# Altium schematic sheet Block Diagram.SchDoc
size B; Author: E. Sims; Organization: Let's Build Rockets Inc.; SheetNumber: 9; SheetTotal: 9
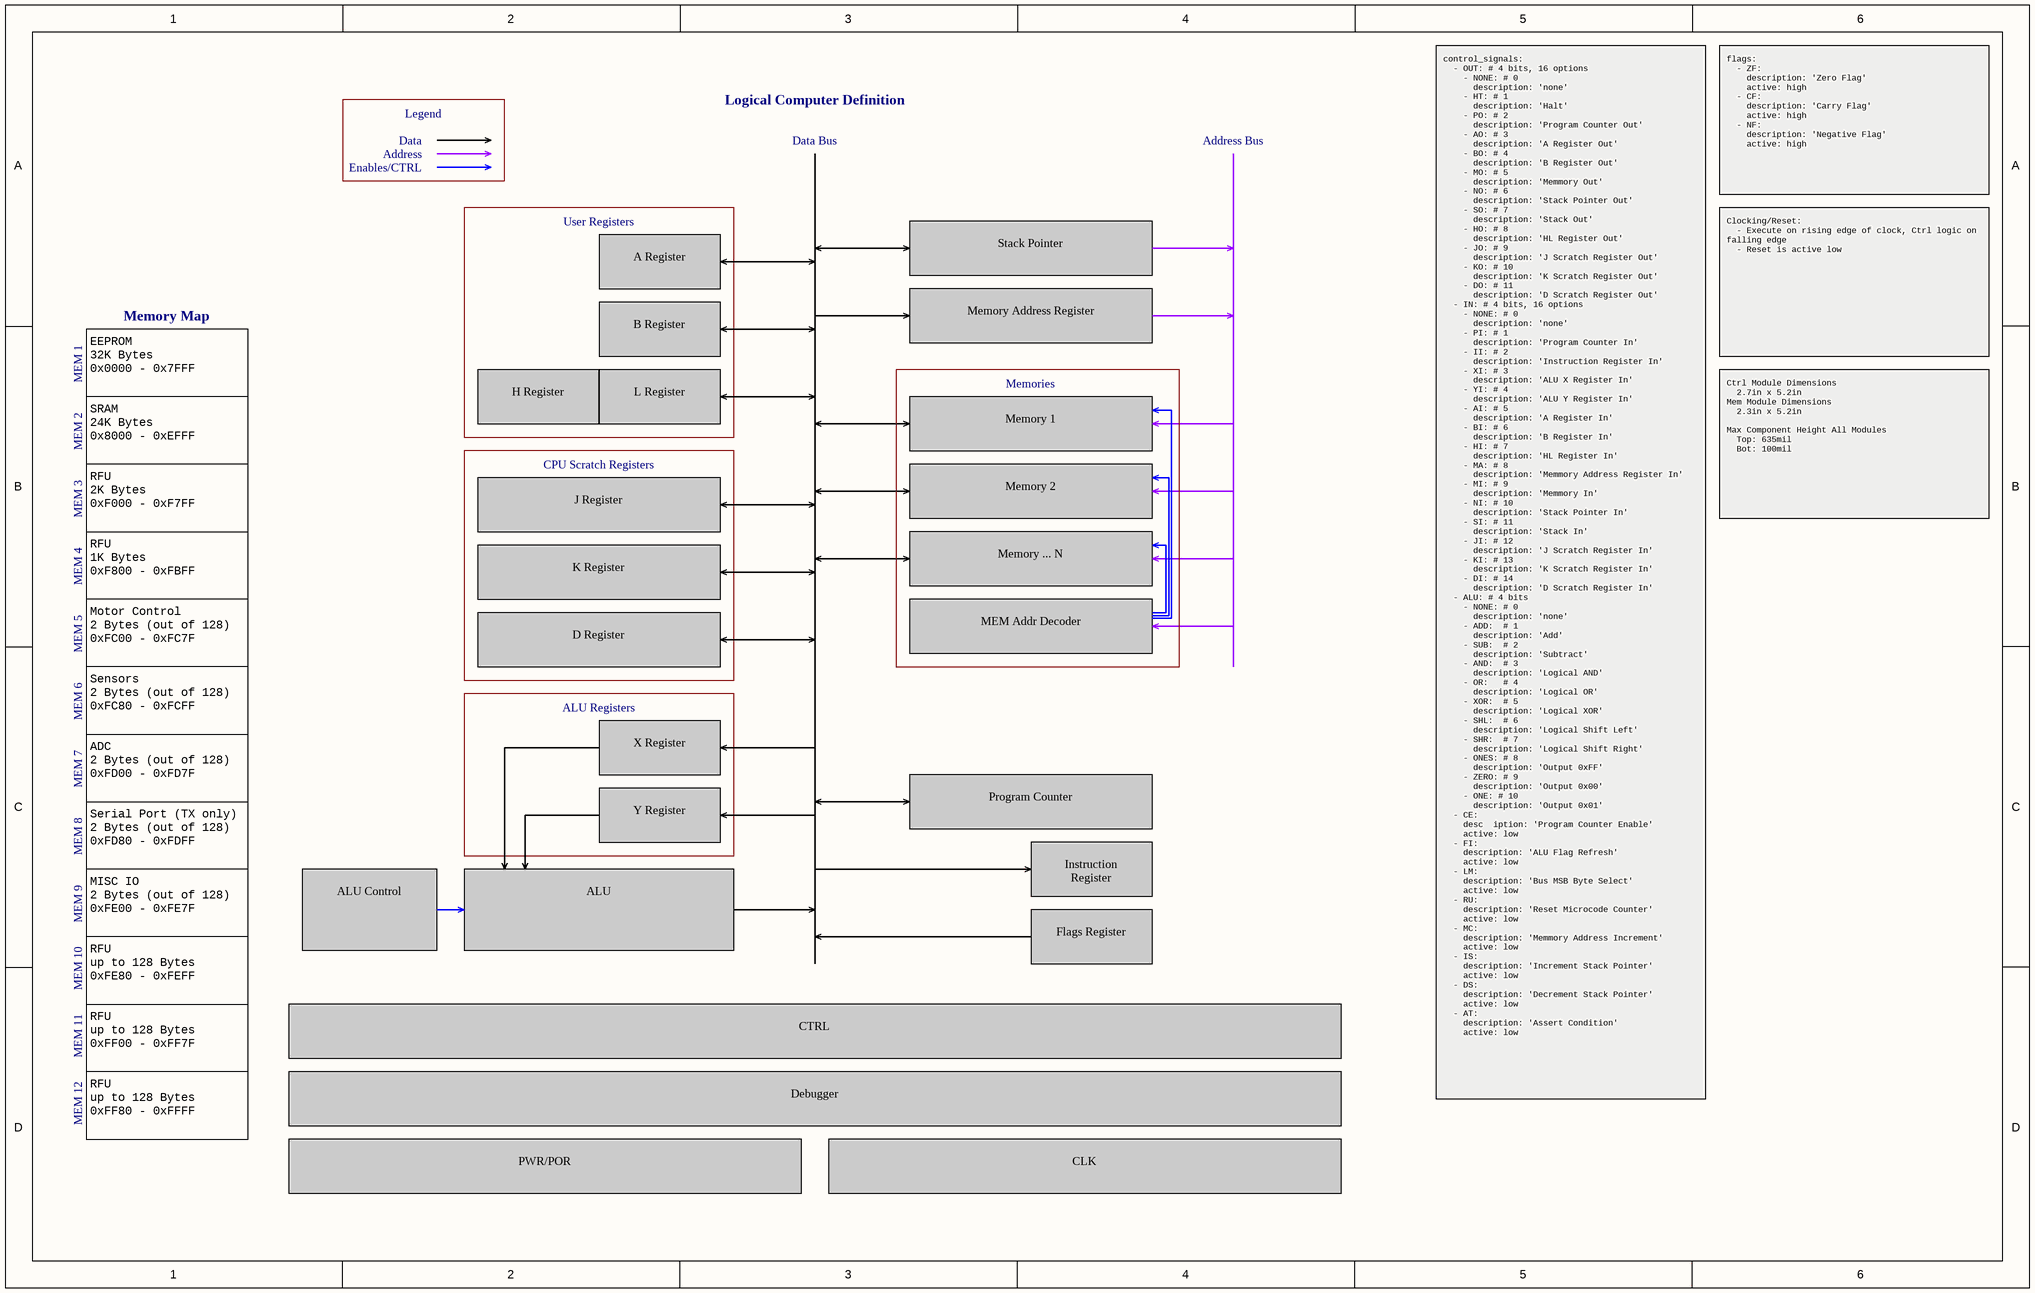
[diagram p0: Block Diagram.SchDoc]

## Notes on the sheet
- Logical Computer Definition
- Data
- Address
- Enables/CTRL
- Legend
- Data Bus
- Address Bus
- User Registers
- flags:
  - ZF:
  description: 'Zero Flag'
  active: high
  - CF:
  description: 'Carry Flag'
  active: high
  - NF:
  description: 'Negative Flag'
  active: high
- A Register
- Stack Pointer
- Memory Map
- B Register
- Memory Address Register
- Clocking/Reset:
  - Execute on rising edge of clock, Ctrl logic on falling edge
  - Reset is active low
- EEPROM
  32K Bytes
  0x0000 - 0x7FFF
- MEM 1
- H Register
- L Register
- Memories
- SRAM
  24K Bytes
  0x8000 - 0xEFFF
- MEM 2
- CPU Scratch Registers
- Memory 1
- RFU
  2K Bytes
  0xF000 - 0xF7FF
- MEM 3
- J Register
- Memory 2
- Ctrl Module Dimensions
  2.7in x 5.2in
  Mem Module Dimensions
  2.3in x 5.2in
  Max Component Height All Modules
  Top: 635mil
  Bot: 100mil
- RFU
  1K Bytes
  0xF800 - 0xFBFF
- MEM 4
- K Register
- Memory ... N
- Motor Control
  2 Bytes (out of 128)
  0xFC00 - 0xFC7F
- MEM 5
- D Register
- ALU Registers
- MEM Addr Decoder
- MEM 6
- Sensors
  2 Bytes (out of 128)
  0xFC80 - 0xFCFF
- X Register
- ADC
  2 Bytes (out of 128)
  0xFD00 - 0xFD7F
- MEM 7
- Y Register
- Program Counter
- Serial Port (TX only)
  2 Bytes (out of 128)
  0xFD80 - 0xFDFF
- MEM 8
- Instruction Register
- MISC IO
  2 Bytes (out of 128)
  0xFE00 - 0xFE7F
- MEM 9
- ALU Control
- ALU
- Flags Register
- MEM 10
- RFU
  up to 128 Bytes
  0xFE80 - 0xFEFF
- MEM 11
- RFU
  up to 128 Bytes
  0xFF00 - 0xFF7F
- CTRL
- control_signals:
  - OUT: # 4 bits, 16 options
  - NONE: # 0
  description: 'none'
  - HT: # 1
  description: 'Halt'
  - PO: # 2
  description: 'Program Counter Out'
  - AO: # 3
  description: 'A Register Out'
  - BO: # 4
  description: 'B Register Out'
  - MO: # 5
  description: 'Memmory Out'
  - NO: # 6
  description: 'Stack Pointer Out'
  - SO: # 7
  description: 'Stack Out'
  - HO: # 8
  description: 'HL Register Out'
  - JO: # 9
  description: 'J Scratch Register Out'
  - KO: # 10
  description: 'K Scratch Register Out'
  - DO: # 11
  description: 'D Scratch Register Out'
  - IN: # 4 bits, 16 options
  - NONE: # 0
  description: 'none'
  - PI: # 1
  description: 'Program Counter In'
  - II: # 2
  description: 'Instruction Register In'
  - XI: # 3
  description: 'ALU X Register In'
  - YI: # 4
  description: 'ALU Y Register In'
  - AI: # 5
  description: 'A Register In'
  - BI: # 6
  description: 'B Register In'
  - HI: # 7
  description: 'HL Register In'
  - MA: # 8
  description: 'Memmory Address Register In'
  - MI: # 9
  description: 'Memmory In'
  - NI: # 10
  description: 'Stack Pointer In'
  - SI: # 11
  description: 'Stack In'
  - JI: # 12
  description: 'J Scratch Register In'
  - KI: # 13
  description: 'K Scratch Register In'
  - DI: # 14
  description: 'D Scratch Register In'
  - ALU: # 4 bits
  - NONE: # 0
  description: 'none'
  - ADD:  # 1
  description: 'Add'
  - SUB:  # 2
  description: 'Subtract'
  - AND:  # 3
  description: 'Logical AND'
  - OR:   # 4
  description: 'Logical OR'
  - XOR:  # 5
  description: 'Logical XOR'
  - SHL:  # 6
  description: 'Logical Shift Left'
  - SHR:  # 7
  description: 'Logical Shift Right'
  - ONES: # 8
  description: 'Output 0xFF'
  - ZERO: # 9
  description: 'Output 0x00'
  - ONE: # 10
  description: 'Output 0x01'
  - CE:
  desc  iption: 'Program Counter Enable'
  active: low
  - FI:
  description: 'ALU Flag Refresh'
  active: low
  - LM:
  description: 'Bus MSB Byte Select'
  active: low
  - RU:
  description: 'Reset Microcode Counter'
  active: low
  - MC:
  description: 'Memmory Address Increment'
  active: low
  - IS:
  description: 'Increment Stack Pointer'
  active: low
  - DS:
  description: 'Decrement Stack Pointer'
  active: low
  - AT:
  description: 'Assert Condition'
  active: low
- RFU
  up to 128 Bytes
  0xFF80 - 0xFFFF
- MEM 12
- Debugger
- PWR/POR
- CLK
- DWG. NO.
- REV.
- SHT.
- REVISION
- DESCRIPTION
- DATE
- APPROVED
- THIS DOCUMENT AND THE DATA DISCLOSED HEREIN OR HEREWITH IS THE PROPERTY OF ALTIUM LIMITED AND MAY BE FREELY DISTRIBUTED IN WHOLE. NO RIGHTS ARE RESERVED OR EXPRESS OR IMPLIED WARANTEE GIVEN.
- ENG:
- DSN:
- APPROVALS
- PROJECT
- DOCUMENT REVISION:
- DESIGN ITEM:
- CHK:
- BOM:
- REFERENCE DOCUMENTS
- PROJECT REVISION:
- TITLE
- FAB DWG:
- PCB DWG:
- ASSY DWG:
- SCALE:
- SIZE
- C
- CAGE CODE
- FILE NAME
- DWG NO.
- SHEET
- OF
- REV